# EasyEDA Pro project 工程技术综合实践课程设计.eprj, board 拓展板PCB
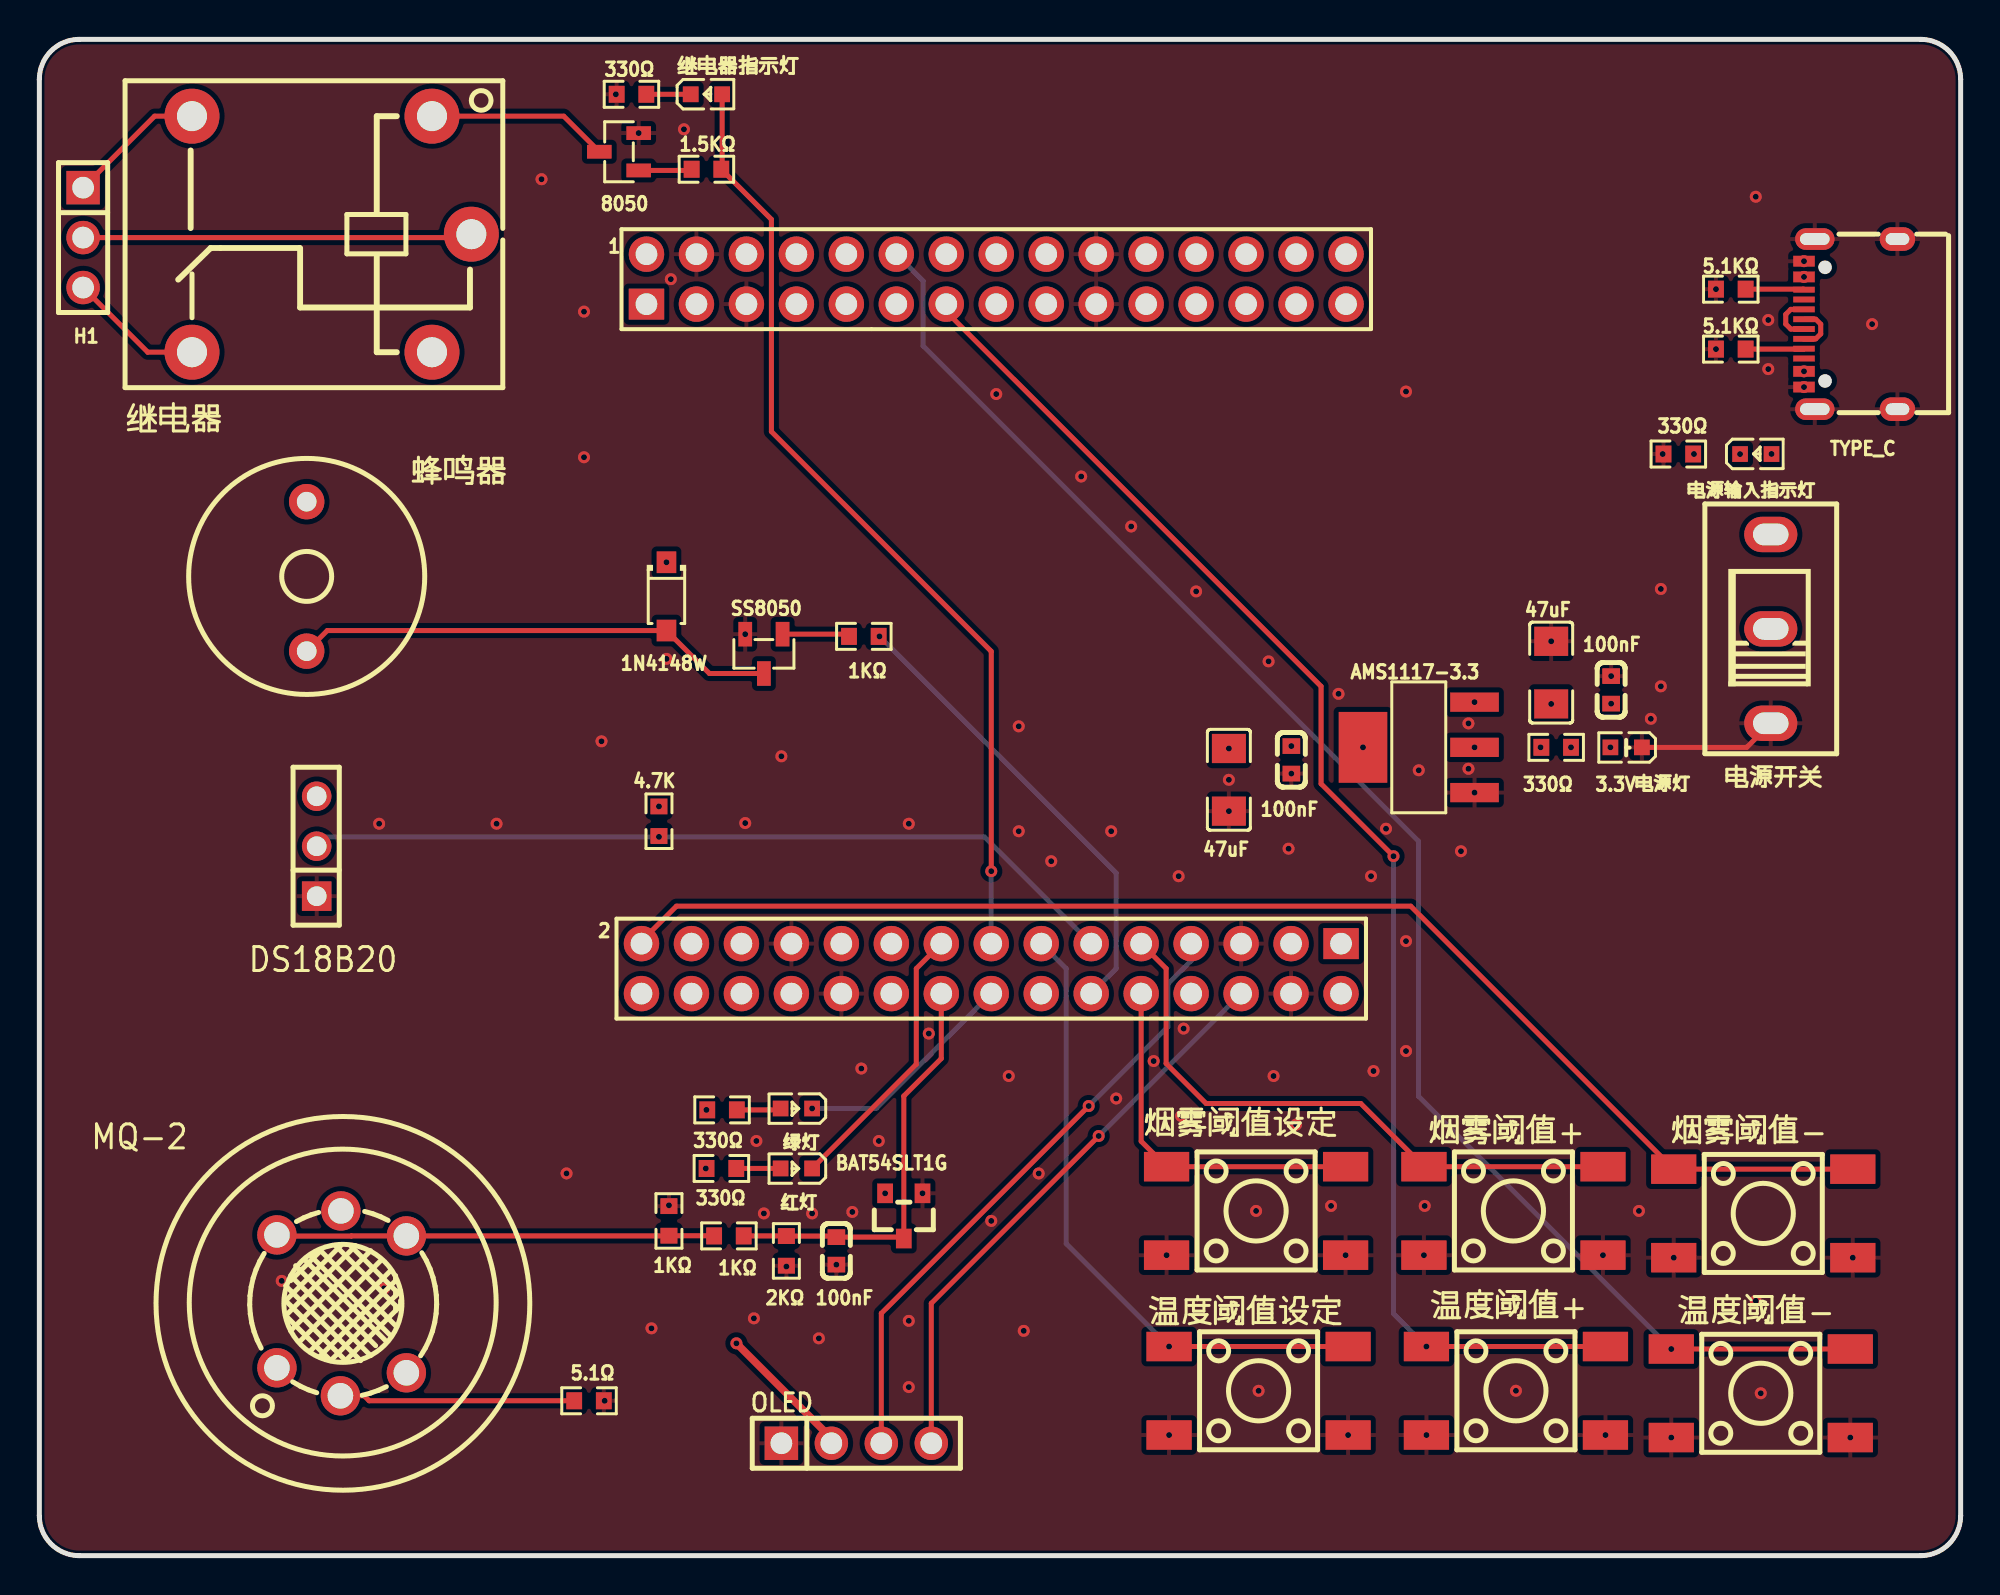
[diagram p2: board, top side]
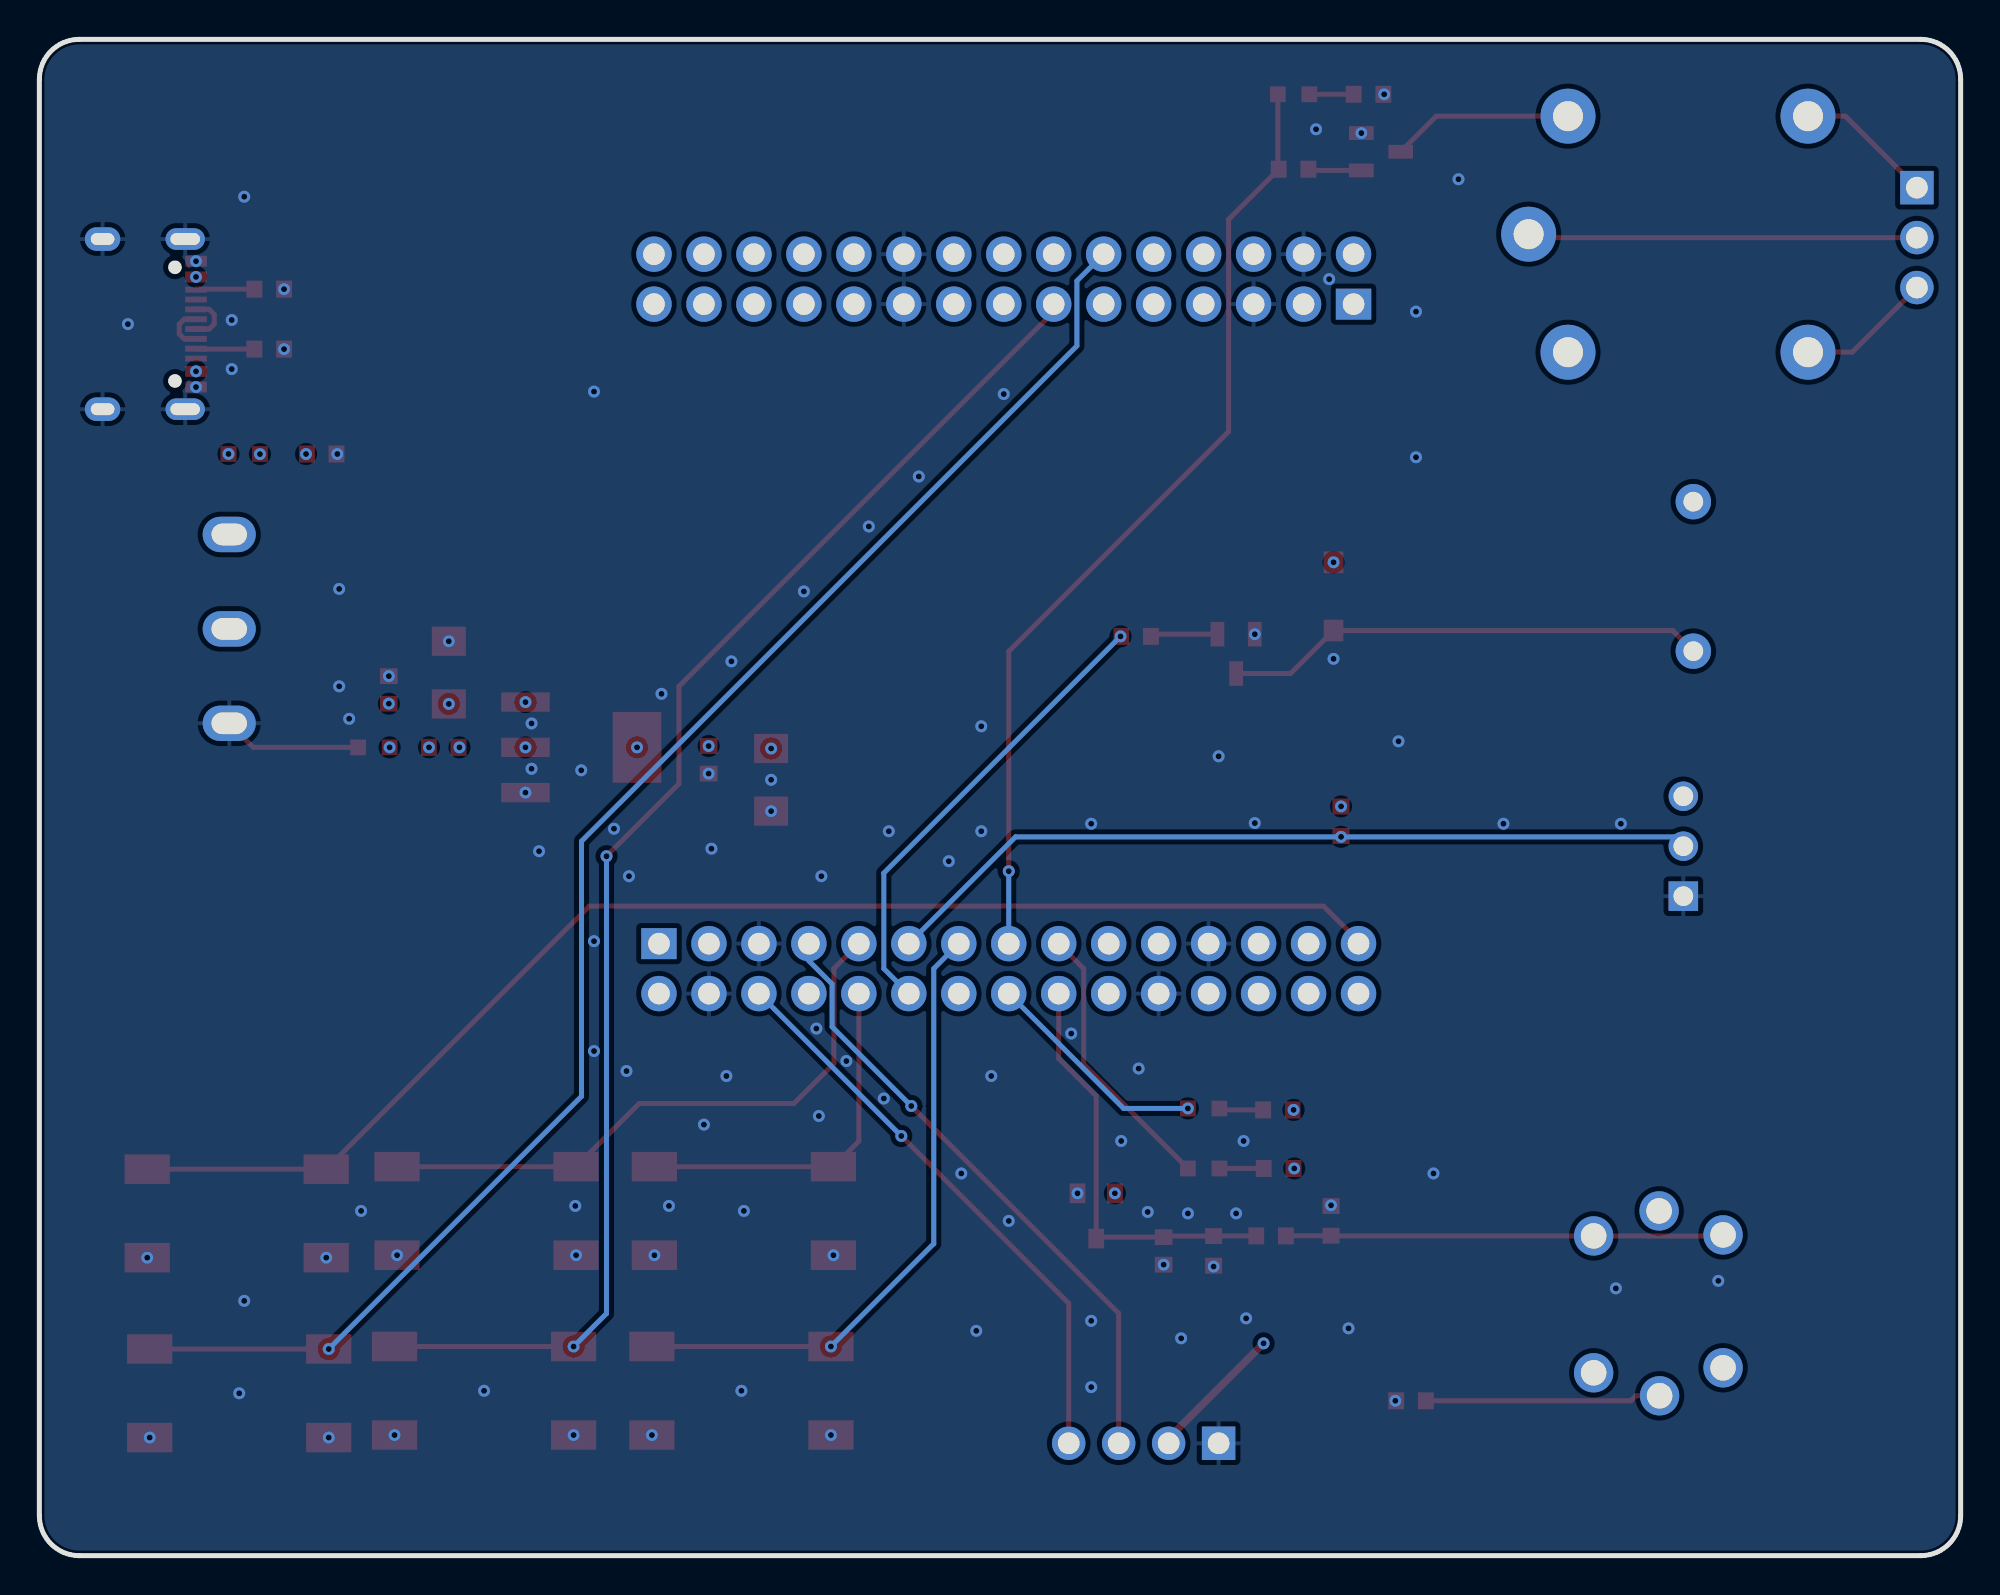
[diagram p3: board, bottom side, seen from below]

Outline 97.66 x 77.09 mm; copper layers: Top Layer, 电源层, GND, Bottom Layer. Coordinates in mm from the lower left corner of the outline.
Outline path: 0,75.06 0,2.03 arc(0.6,0.6) 2.03,0 95.63,0 arc(97.07,0.6) 97.66,2.03 97.66,75.06 arc(97.07,76.49) 95.63,77.09 2.03,77.09 arc(0.6,76.49) 0,75.06
Stack: Top Layer 0.035mm 外层铜厚1oz / Dielectric1 0.2104mm 7628 RC49% 8.6mil / 电源层 0.0152mm 内层铜厚 / Dielectric2 1.065mm 1.1mm H/HOZ Copper / GND 0.0152mm 内层铜厚 / Dielectric3 0.2104mm 7628 RC49% 8.6mil / Bottom Layer 0.035mm 外层铜厚1oz

## Design rules (mm)
template: JLCPCB Capability(Two Layers Board)
spacing copperThickness1oz (default): track to track 0.102, other pairs 0.152 to 0.3
spacing copperThickness2oz: track to track 0.203, other pairs 0.152 to 0.3
track width copperThickness1oz (default): min 0.127, default 0.254, max 2.54
track width copperThickness2oz: min 0.203, default 0.254, max 2.54
differential pair differentialPair (default): width min 0.127, default 0.254, max 2.54; gap min 0.152, default 0.152
via viaSize (default): diameter min 0.5, default 0.61, max 10; hole min 0.3, default 0.305, max 6.3

## Placement (name value [footprint] x y rotation side)
1  COM2X15_2.54_DIP  [HDR-TH_30P-P2.54-V-M-R2-C15-S2.54]  48.64 64.9 0 top
1.5KΩ  1.5kΩ  [R0603]  33.91 70.48 0 top
1KΩ  -  [R0603]  35.05 16.26 180 top
1KΩ#2  -  [R0603]  32 17.02 90 top
1KΩ#3  -  [R0603]  41.91 46.74 180 top
1N4148W  1N4148W  [SOD-123F_L2.7-W1.6-LS3.8-RD]  31.88 48.77 270 top
2  COM2X15_2.54_DIP  [HDR-TH_30P-P2.54-V-M-R2-C15-S2.54]  48.39 29.84 180 top
2KΩ  2kΩ  [R0603]  37.97 15.49 90 top
3.3V电源灯  KT-0603W  [LED0603-R-RD_WHITE]  80.66 41.09 180 top
4.7K  4.7kΩ  [R0603]  31.5 37.34 90 top
5.1KΩ  -  [R0603]  85.98 64.39 180 top
5.1KΩ#2  -  [R0603]  85.98 61.34 180 top
5.1Ω  5.1Ω  [R0603]  27.94 7.87 180 top
47uF  -  [C1206]  76.85 44.89 270 top
47uF#2  -  [C1206]  60.47 39.44 90 top
100nF  -  [C0603]  40.51 15.49 90 top
100nF#2  -  [C0603]  79.9 44.02 270 top
100nF#3  -  [C0603]  63.64 40.46 90 top
330Ω  -  [R0603]  30.1 74.3 0 top
330Ω#2  -  [R0603]  83.31 56.01 0 top
330Ω#3  -  [R0603]  77.1 41.09 0 top
330Ω#4  -  [R0603]  34.67 19.69 0 top
330Ω#5  -  [R0603]  34.7 22.66 0 top
8050  SS8050(RANGE:200-350)  [SOT-23-3_L2.9-W1.3-P1.90-LS2.4-BR]  29.46 71.37 0 top
AMS1117-3.3  AMS1117-3.3  [SOT-223-4_L6.5-W3.5-P2.30-LS7.0-BR]  70.12 41.09 0 top
BAT54SLT1G  BAT54SLT1G  [SOT-23_L2.9-W1.3-P1.90-LS2.4-BR]  43.94 17.27 90 top
DS18B20  排母2.54mm 1X3pin  [HDR-TH_3P-P2.54_CS-1165SDIG]  14.1 36.07 90 top
H1  PZ254V-11-03P  [HDR-TH_3P-P2.54-V-M]  2.22 67.01 270 top
MQ-2  MQ-2  [SENSOR-TH_MQ-2]  15.37 12.83 90 top
OLED  PM2.54-1*4  [HDR-TH_4P-P2.54-V-F]  41.53 5.72 0 top
SS8050  SS8050(RANGE:200-350)  [SOT-23-3_L2.9-W1.3-P1.90-LS2.4-BR]  36.83 45.85 90 top
TYPE_C  TYPE-C 16PIN 2MD(073)  [USB-C-SMD_TYPE-C-6PIN-2MD-073]  92.08 62.61 90 top
温度阈值+  KH-6X6X5H-STM  [SW-SMD_4P-L6.0-W6.0-P4.50-LS9.0_H5.0]  75.06 8.38 0 top
温度阈值-  KH-6X6X5H-STM  [SW-SMD_4P-L6.0-W6.0-P4.50-LS9.0_H5.0]  87.5 8.25 0 top
温度阈值设定  KH-6X6X5H-STM  [SW-SMD_4P-L6.0-W6.0-P4.50-LS9.0_H5.0]  61.98 8.38 0 top
烟雾阈值+  KH-6X6X5H-STM  [SW-SMD_4P-L6.0-W6.0-P4.50-LS9.0_H5.0]  74.93 17.53 0 top
烟雾阈值-  KH-6X6X5H-STM  [SW-SMD_4P-L6.0-W6.0-P4.50-LS9.0_H5.0]  87.63 17.4 0 top
烟雾阈值设定  KH-6X6X5H-STM  [SW-SMD_4P-L6.0-W6.0-P4.50-LS9.0_H5.0]  61.85 17.53 0 top
电源开关  SS-12D10G6-G  [SW-TH_SS-12D10G4-G]  88.01 47.12 90 top
电源输入指示灯  NCD0603Y2  [LED0603-RD]  87.25 56.01 0 top
红灯  NCD0603Y2  [LED0603-RD]  38.48 19.69 180 top
继电器  SRD-12VDC-SL-C  [RELAY-TH_SRD-XXVDC-XL-C]  14.86 67.18 180 top
继电器指示灯  NCD0603Y2  [LED0603-RD]  33.91 74.3 0 top
绿灯  NCD0603Y2  [LED0603-RD]  38.48 22.73 180 top
蜂鸣器  2.4kHz  [BUZ-TH_BD12.0-P7.60-D0.6-FD]  13.59 49.78 270 top

## Footprints (pads in the part's own frame, mm; a bottom-side part is the same pattern mirrored in y, then rotated)
BUZ-TH_BD12.0-P7.60-D0.6-FD
  round 1.8 hole 1: 1(-3.8,0) 2(3.8,0)
C0603
  rect 0.8x0.9 smd: 1(-0.7,0) 2(0.7,0)
C1206
  rect 1.485x1.728 smd: 1(-1.593,0) 2(1.593,0)
HDR-TH_3P-P2.54-V-M
  rect 1.7x1.7 hole 1.1: 1(-2.54,0)
  round 1.7 hole 1.1: 2(0,0) 3(2.54,0)
HDR-TH_3P-P2.54_CS-1165SDIG
  rect 1.5x1.5 hole 1: 1(-2.54,0)
  round 1.5 hole 1: 2(0,0) 3(2.54,0)
HDR-TH_4P-P2.54-V-F
  rect 1.7x1.7 hole 1.1: 1(-3.81,0)
  round 1.7 hole 1.1: 2(-1.27,0) 3(1.27,0) 4(3.81,0)
HDR-TH_30P-P2.54-V-M-R2-C15-S2.54
  rect 1.8x1.575 hole 1.1: 1(-17.78,-1.27)
  round 1.8 hole 1.1: 2(-17.78,1.27) 3(-15.24,-1.27) 4(-15.24,1.27) 5(-12.7,-1.27) 6(-12.7,1.27) 7(-10.16,-1.27) 8(-10.16,1.27) 9(-7.62,-1.27) 10(-7.62,1.27) 11(-5.08,-1.27) 12(-5.08,1.27) 13(-2.54,-1.27) 14(-2.54,1.27) 15(0,-1.27) 16(0,1.27) 17(2.54,-1.27) 18(2.54,1.27) 19(5.08,-1.27) 20(5.08,1.27) 21(7.62,-1.27) 22(7.62,1.27) 23(10.16,-1.27) 24(10.16,1.27) 25(12.7,-1.27) 26(12.7,1.27) 27(15.24,-1.27) 28(15.24,1.27) 29(17.78,-1.27) 30(17.78,1.27)
LED0603-R-RD_WHITE
  rect 0.8x0.8 smd: 1(0.8,0) 2(-0.8,0)
LED0603-RD
  rect 0.8x0.8 smd: 1(-0.799,0) 2(0.799,0)
R0603
  rect 0.806x0.864 smd: 1(-0.753,0) 2(0.753,0)
RELAY-TH_SRD-XXVDC-XL-C
  round 2.794 hole 1.524: 1(-5.1,-6) 2(7.1,-6) 3(7.1,6) 4(-5.1,6) 5(-7.1,0)
SENSOR-TH_MQ-2
  round 2 hole 1.3: 1(-3.276,3.289) 2(-4.699,0.064) 3(-3.53,-3.289) 4(3.429,-3.289) 5(4.699,0.038) 6(3.48,3.289)
SOD-123F_L2.7-W1.6-LS3.8-RD
  rect 1.1x1 smd: 1(-1.735,0) 2(1.735,0)
SOT-23-3_L2.9-W1.3-P1.90-LS2.4-BR
  rect 1.25x0.7 smd: 1(1,-0.95) 2(1,0.95) 3(-1,0)
SOT-23_L2.9-W1.3-P1.90-LS2.4-BR
  rect 1x0.8 smd: 1(1.15,-0.95) 2(1.15,0.95) 3(-1.15,0)
SOT-223-4_L6.5-W3.5-P2.30-LS7.0-BR
  rect 2.47x0.98 smd: 1(2.835,-2.3) 2(2.835,0) 3(2.835,2.3)
  rect 2.47x3.6 smd: 4(-2.835,0)
SW-SMD_4P-L6.0-W6.0-P4.50-LS9.0_H5.0
  rect 2.3x1.5 smd: 1(-4.55,2.25) 2(4.55,2.25) 3(-4.55,-2.25) 4(4.55,-2.25)
SW-TH_SS-12D10G4-G
  oval 1.8x2.7 hole 1.1x1.8: 1(-4.8,0) 2(-0.001,0) 3(4.8,0)
USB-C-SMD_TYPE-C-6PIN-2MD-073
  rect 0.55x1.1 smd: 1(-3.2,2.375) 2(-2.4,2.375) 11(2.4,2.375) 12(3.2,2.375)
  rect 0.3x1.1 smd: 3(-1.75,2.375) 4(-1.25,2.375) 5(-0.75,2.375) 6(-0.25,2.375) 7(0.25,2.375) 8(0.75,2.375) 9(1.25,2.375) 10(1.75,2.375)
  oval 1.1x2 hole 0.6x1.5: 13(-4.325,1.825) 14(4.325,1.825)
  oval 1.2x1.8 hole 0.6x1.2: 13(-4.325,-2.375) 14(4.325,-2.375)

## Nets
5V: 1.3 1.18 1N4148W.1 2.3 2.21 47uF.2 100nF#2.2 AMS1117-3.3.3 MQ-2.1 MQ-2.3 MQ-2.5 电源开关.2 继电器.4 蜂鸣器.1
GND: 1.4 1.5 1.19 1.20 1KΩ#2.2 2.4 2.5 2.22 2.23 2KΩ.1 3.3V电源灯.2 5.1KΩ.2 5.1KΩ#2.2 5.1Ω.1 47uF.1 47uF#2.1 100nF.1 100nF#2.1 100nF#3.1 330Ω.1 330Ω#2.1 8050.2 AMS1117-3.3.1 BAT54SLT1G.1 DS18B20.1 OLED.1 SS8050.2 TYPE_C.1 TYPE_C.12 TYPE_C.13 TYPE_C.14 温度阈值+.3 温度阈值+.4 温度阈值-.3 温度阈值-.4 温度阈值设定.3 温度阈值设定.4 烟雾阈值+.3 烟雾阈值+.4 烟雾阈值-.3 烟雾阈值-.4 烟雾阈值设定.3 烟雾阈值设定.4 电源开关.1
VCC: 1.1 1.2 1.16 1.17 2.1 2.2 2.19 2.20 4.7K.2 47uF#2.2 100nF#3.2 330Ω#3.1 330Ω#4.1 330Ω#5.1 AMS1117-3.3.2 AMS1117-3.3.4 BAT54SLT1G.2 DS18B20.3 OLED.2
VIN: TYPE_C.2 TYPE_C.11 电源开关.3 电源输入指示灯.2
PA0: 1KΩ.1 2.18 2KΩ.2 100nF.2 BAT54SLT1G.3
PA1: 2.17 红灯.1
PA2: 2.16 绿灯.1
PA3: 1.5KΩ.2 2.15 继电器指示灯.2
PA4: 2.14
PA5: 2.13 温度阈值设定.1 温度阈值设定.2
PA6: 1KΩ#3.1 2.12
PA7: 2.11 4.7K.1 DS18B20.2
PA8: 1.26
PA9: 1.25
PA10: 1.24
PA15: 1.14
PB0: 2.10 烟雾阈值设定.1 烟雾阈值设定.2
PB1: 2.9 烟雾阈值+.1 烟雾阈值+.2
PB3: 1.13 温度阈值+.1 温度阈值+.2
PB4: 1.12 温度阈值-.1 温度阈值-.2
PB5: 1.11
PB8: 1.7
PB9: 1.6
PB10: 2.7 OLED.3
PB11: 2.6 OLED.4
PB12: 1.30
PB13: 1.29
PB14: 1.28
PB15: 1.27
PC13: 2.29 烟雾阈值-.1 烟雾阈值-.2
PC14: 2.28
PC15: 2.27
PD0: 2.26
PD1: 2.25
SWCLK: 1.15
SWDIO: 1.21
USB1D_M: 1.23
USB1D_P: 1.22
USB2D_M: 1.10
USB2D_P: 1.9
USB_D+: TYPE_C.6 TYPE_C.8
USB_D-: TYPE_C.5 TYPE_C.7
$1N2372: 1KΩ.2 1KΩ#2.1 MQ-2.4 MQ-2.6
$1N2803: 1KΩ#3.2 SS8050.1
$1N3400: 5.1Ω.2 MQ-2.2
$1N3711: 1N4148W.2 SS8050.3 蜂鸣器.2
$1N4660: 330Ω#2.2 电源输入指示灯.1
$1N4756: 330Ω#4.2 红灯.2
$1N4760: 330Ω#5.2 绿灯.2
$1N5679: 8050.3 继电器.1
$1N5767: 1.5KΩ.1 8050.1
$1N5923: 330Ω.2 继电器指示灯.1
$1N6045: H1.2 继电器.5
$1N6055: H1.3 继电器.3
$1N6065: H1.1 继电器.2
$1N8581: 5.1KΩ.1 TYPE_C.10
$1N8582: 5.1KΩ#2.1 TYPE_C.4
$1N8605: 3.3V电源灯.1 330Ω#3.2

Pads without a net: 1 8; 2 8 24 30; TYPE_C 3 9

## Via types
v1: diameter 0.61, hole 0.305, Top Layer to Bottom Layer, 136 vias

## Routing (per net, layer and track width the routed paths; a pad name or vN(x,y) marks a point on that pad's centre or on a via; arc(x,y) is an arc through that point)
5V: length 259.1
  电源层 w0.381: 66.17,26.67 60.71,26.67 43.33,9.3 MQ-2.3 18.66,9.47 15.33,12.8 ; 66.17,26.67 67.56,26.67 84.21,43.32 ; 66.17,26.67 64.88,27.96 64.88,29.86 63.63,31.12 ; 15.33,12.8 MQ-2.1 ; 15.33,12.8 MQ-2.5 29.36,31.56 29.36,31.63 30.09,32.36 30.16,32.36 30.44,32.64 39.5,32.64 40.77,31.37 2.21 ; 36.34,68.34 49.01,68.34 ; 36.34,68.34 27.12,68.34 继电器.4 13.59,54.81 蜂鸣器.1 ; 36.34,68.34 34.67,66.67 34.67,64.9 1.3 32,62.23 32,50.63 v1(31.88,50.5) ; 49.01,68.34 67.29,68.34 71.63,64.01 71.63,44.72 v1(72.95,43.39) 73.05,43.3 v1(76.85,43.3) 76.86,43.32 v1(79.9,43.32) 84.21,43.32 ; 49.01,68.34 1.18 ; 电源开关.2 84.21,43.32
GND: length 355.5
  Top Layer w0.254: 电源开关.1 86.79,41.09 3.3V电源灯.2
  GND w0.254: v1(76.85,46.49) 78.13,46.49 v1(79.9,44.72) 85.61,44.72 电源开关.1 ; v1(76.85,46.49) 82.52,52.16 v1(82.52,56.01) 82.52,58.63 v1(85.23,61.34) ; v1(76.85,46.49) 74.8,44.44 74.8,40.64 v1(72.95,38.79) 64.61,38.79 v1(63.64,39.76) 62.37,39.76 v1(60.47,37.85) 60.47,31.74 2.5 66.4,25.8 v1(66.4,15.28) ; v1(37.97,14.7) 37.97,5.97 OLED.1 ; v1(37.97,14.7) 35.12,14.7 v1(32,17.81) 16.29,33.53 DS18B20.1 ; v1(37.97,14.7) 40.42,14.7 v1(40.51,14.79) 41.26,14.79 v1(44.89,18.42) 44.89,24.45 2.22 2.23 35.88,33.46 v1(35.88,37.24) v1(35.88,46.85) 35.94,46.91 1.5 ; OLED.1 40.26,3.18 54.74,3.18 57.43,5.86 v1(57.43,6.13) v1(66.53,6.13) v1(70.51,6.13) v1(79.61,6.13) 79.73,6 v1(82.95,6) v1(92.05,6) 92.18,6.13 v1(92.18,15.15) v1(83.08,15.15) 82.95,15.28 v1(79.48,15.28) v1(70.38,15.28) v1(66.4,15.28) ; OLED.1 35.56,7.87 v1(28.73,7.87) ; v1(85.23,61.34) 87.16,59.41 v1(89.7,59.41) 90.25,58.86 TYPE_C.13 TYPE_C.13 ; v1(85.23,61.34) v1(85.23,64.39) 86.65,65.81 v1(89.7,65.81) 90.25,66.36 TYPE_C.14 TYPE_C.14 ; v1(66.4,15.28) v1(57.3,15.28) ; 1.5 38.35,61.21 51.31,61.21 1.19 1.20 ; 1.5 1.4 33.4,69.39 v1(30.46,72.32) 29.3,73.48 v1(29.3,74.3)
  vias: v1(12.32,13.97) v1(17.27,37.21) v1(17.53,13.59) v1(23.24,37.21) v1(25.53,69.98) v1(26.8,19.43) v1(27.69,63.25) v1(27.69,55.84) v1(28.58,41.4) v1(31.11,11.56) v1(31.88,45.59) v1(32.1,64.9) v1(32.77,72.52) v1(36.32,12.06) v1(36.45,21.08) v1(36.83,17.4) v1(37.72,40.64) v1(39.28,17.4) v1(39.62,11.05) v1(41.33,17.47) v1(41.78,24.77) v1(42.67,21.08) v1(44.2,37.21) v1(44.2,11.94) v1(44.2,8.57) v1(45.21,26.54) v1(48.39,17.02) v1(48.64,59.06) v1(49.28,24.38) v1(49.78,42.16) v1(49.78,36.83) v1(50.04,11.43) v1(50.8,19.43) v1(51.44,35.31) v1(52.96,54.86) v1(54.48,36.83) v1(54.74,23.24) v1(55.5,52.32) v1(56.64,25.15) v1(57.91,34.54) v1(58.04,22.35) v1(58.17,26.8) v1(58.8,49.02) v1(60.47,39.44) v1(61.85,17.53) v1(61.98,8.38) v1(62.48,45.47) v1(62.74,24.38) v1(63.5,35.94) v1(63.88,21.91) v1(65.66,17.78) v1(66.04,43.81) v1(67.69,34.54) v1(67.82,24.64) v1(68.45,36.96) v1(69.47,59.18) v1(69.47,31.24) v1(69.47,25.65) v1(70.12,39.93) v1(70.42,17.78) v1(72.26,35.81) v1(72.64,42.31) v1(72.64,40.01) v1(75.06,8.38) v1(81.31,17.53) v1(81.92,42.55) v1(82.42,49.15) v1(82.42,44.2) v1(87.25,69.09) v1(87.25,12.95) v1(87.5,8.25) v1(87.88,62.82) v1(87.88,60.33) v1(93.16,62.61)
VCC: length 197.5
  Top Layer w0.381: v1(35.43,10.8) 40.26,5.97 OLED.2
  电源层 w0.381: 2.2 2.1 66.17,39.98 v1(67.28,41.09) ; 1.2 1.1 30.86,43.36 36.13,38.09 ; 1.16 1.17 51.18,39.88 52.97,38.09 ; v1(33.88,19.69) 33.88,12.35 v1(35.43,10.8) ; v1(33.88,19.69) 33.91,19.72 v1(33.91,22.66) 35.5,24.26 38.99,24.26 2.20 2.19 43.56,31.12 45.85,33.4 52.83,33.4 57.47,38.04 ; v1(33.88,19.69) 35.14,18.42 v1(42.99,18.42) ; 36.13,38.09 v1(31.5,38.09) 14.61,38.09 DS18B20.3 ; 36.13,38.09 52.97,38.09 ; 52.97,38.09 57.42,38.09 57.47,38.04 ; v1(67.28,41.09) v1(72.95,41.09) v1(76.31,41.09) ; v1(67.28,41.09) 63.71,41.09 v1(63.64,41.16) 63.52,41.04 v1(60.47,41.04) 57.47,38.04
VIN: length 14.1
  电源层 w0.381: 电源开关.3 88.05,51.95 v1(88.05,56.01) 88.01,56.05 88.01,58.93 89.29,60.21 v1(89.7,60.21) v1(89.7,65.01)
PA0: length 21.4
  Top Layer w0.254: 45.85,28.58 45.85,25.27 43.94,23.37 BAT54SLT1G.3 43.87,16.19 100nF.2 40.46,16.25 2KΩ.2 37.96,16.26 1KΩ.1
PA1: length 14.1
  Top Layer w0.254: 红灯.1 44.58,24.98 44.58,29.84 45.85,31.12
PA2: length 11.5
  Bottom Layer w0.254: 2.16 42.55,22.74 v1(39.28,22.74)
PA3: length 48.9
  Top Layer w0.254: v1(48.39,34.8) 48.39,45.97 37.21,57.15 37.21,67.94 1.5KΩ.2 34.71,70.53 继电器指示灯.2
  Bottom Layer w0.254: v1(48.39,34.8) 2.15
PA5: length 32.3
  Top Layer w0.254: v1(57.43,10.63) 温度阈值设定.2
  Bottom Layer w0.254: 2.13 52.2,29.84 52.2,15.86 v1(57.43,10.63)
PA6: length 23.7
  Bottom Layer w0.254: v1(42.7,46.74) 54.74,34.7 54.74,29.84 53.47,28.58
PA7: length 41.8
  Bottom Layer w0.254: 53.47,31.12 48.04,36.54 v1(31.5,36.54) 14.57,36.54 DS18B20.2
PB0: length 18.4
  Top Layer w0.254: 烟雾阈值设定.2 烟雾阈值设定.1 56.01,21.07 56.01,28.58
PB1: length 31
  Top Layer w0.254: 56.01,31.12 57.28,29.84 57.28,25.02 59.31,22.99 67.17,22.99 烟雾阈值+.1 烟雾阈值+.2
PB3: length 72.2
  Top Layer w0.254: v1(70.51,10.63) 温度阈值+.2 ; v1(68.83,35.56) 65.15,39.24 65.15,44.2 46.1,63.25 1.13
  Bottom Layer w0.254: v1(68.83,35.56) 68.83,12.31 v1(70.51,10.63)
PB4: length 81.1
  Top Layer w0.254: v1(82.95,10.5) 92.05,10.5
  Bottom Layer w0.254: v1(82.95,10.5) 70.1,23.35 70.1,36.32 44.92,61.5 44.92,64.81 1.12
PB10: length 31.9
  Top Layer w0.254: 42.8,5.72 42.8,12.32 v1(53.34,22.86)
  Bottom Layer w0.254: 2.7 58.55,30.24 57.37,29.06 57.37,26.89 v1(53.34,22.86)
PB11: length 29.4
  Top Layer w0.254: OLED.4 45.34,12.83 v1(53.85,21.34)
  Bottom Layer w0.254: 2.6 v1(53.85,21.34)
PC13: length 68
  Top Layer w0.254: 烟雾阈值-.2 烟雾阈值-.1 69.71,33.02 32.39,33.02 30.61,31.24 2.29
USB_D+: length 2.6
  Top Layer w0.254: TYPE_C.8 89.03,63.36 88.77,63.11 88.77,62.62 89.03,62.36 TYPE_C.6
USB_D-: length 2.4
  Top Layer w0.254: TYPE_C.7 90.3,62.86 90.55,62.61 90.55,62.12 90.3,61.86 TYPE_C.5
$1N2372: length 22.3
  Top Layer w0.254: 12.08,16.31 12.14,16.25 15.86,16.25 15.87,16.26 MQ-2.4 32,16.26 1KΩ#2.1 34.29,16.26 1KΩ.2
$1N2803: length 3.4
  Top Layer w0.254: 1KΩ#3.2 41.05,46.85 SS8050.1
$1N3400: length 12
  Top Layer w0.254: 5.1Ω.2 16.76,7.87 16.51,8.13 MQ-2.2
$1N3711: length 24.6
  Top Layer w0.254: 蜂鸣器.2 14.64,47.03 1N4148W.2 34.06,44.85 SS8050.3
$1N4660: length 2.3
  电源层 w0.381: v1(86.45,56) 84.11,56 v1(84.11,56.01)
$1N4756: length 2.3
  Top Layer w0.254: 330Ω#4.2 红灯.2
$1N4760: length 2.3
  Top Layer w0.254: 330Ω#5.2 37.61,22.66 绿灯.2
$1N5679: length 9.3
  Top Layer w0.254: 8050.3 26.66,73.18 继电器.1
$1N5767: length 2.7
  Top Layer w0.254: 8050.1 33.09,70.42 1.5KΩ.1
$1N5923: length 2.3
  Top Layer w0.254: 330Ω.2 继电器指示灯.1
$1N6045: length 19.8
  Top Layer w0.254: H1.2 21.79,67.01 继电器.5
$1N6055: length 6.9
  Top Layer w0.254: H1.3 5.51,61.18 7.76,61.18
$1N6065: length 7
  Top Layer w0.254: 7.76,73.18 5.86,73.18 H1.1
$1N8581: length 3
  Top Layer w0.254: 5.1KΩ.1 89.67,64.39 TYPE_C.10
$1N8582: length 3
  Top Layer w0.254: 5.1KΩ#2.1 89.68,61.34 TYPE_C.4
$1N8605: length 2
  电源层 w0.381: v1(77.86,41.09) v1(79.86,41.09)

## Copper pours and planes (outline as drawn; the poured copper is in the pictures)
GND on Top Layer: -0.13,75.18 -0.12,75.36 -0.07,75.64 0.01,75.91 0.13,76.17 0.28,76.41 0.47,76.62 0.68,76.81 0.92,76.96 1.18,77.08 1.45,77.16 1.73,77.21 1.91,77.22 95.76,77.22 95.94,77.21 96.22,77.16 96.49,77.08 96.74,76.96 96.98,76.81 97.19,76.62 97.38,76.41 97.54,76.17 97.66,75.91 97.74,75.64 97.78,75.36 97.79,75.18 97.79,1.91 97.78,1.73 97.74,1.45 97.66,1.18 97.54,0.92 97.38,0.68 97.19,0.47 96.98,0.28 96.74,0.13 96.49,0.01 96.22,-0.07 95.94,-0.12 95.76,-0.13 1.91,-0.13 1.73,-0.12 1.45,-0.07 1.18,0.01 0.92,0.13 0.68,0.28 0.47,0.47 0.28,0.68 0.13,0.92 0.01,1.18 -0.07,1.45 -0.12,1.73 -0.13,1.91
GND on Bottom Layer: -0.13,75.18 -0.12,75.36 -0.07,75.64 0.01,75.91 0.13,76.17 0.28,76.41 0.47,76.62 0.68,76.81 0.92,76.96 1.18,77.08 1.45,77.16 1.73,77.21 1.91,77.22 95.76,77.22 95.94,77.21 96.22,77.16 96.49,77.08 96.74,76.96 96.98,76.81 97.19,76.62 97.38,76.41 97.54,76.17 97.66,75.91 97.74,75.64 97.78,75.36 97.79,75.18 97.79,1.91 97.78,1.73 97.74,1.45 97.66,1.18 97.54,0.92 97.38,0.68 97.19,0.47 96.98,0.28 96.74,0.13 96.49,0.01 96.22,-0.07 95.94,-0.12 95.76,-0.13 1.91,-0.13 1.73,-0.12 1.45,-0.07 1.18,0.01 0.92,0.13 0.68,0.28 0.47,0.47 0.28,0.68 0.13,0.92 0.01,1.18 -0.07,1.45 -0.12,1.73 -0.13,1.91
GND on 电源层: -0.13,75.18 -0.12,75.36 -0.07,75.64 0.01,75.91 0.13,76.17 0.28,76.41 0.47,76.62 0.68,76.81 0.92,76.96 1.18,77.08 1.45,77.16 1.73,77.21 1.91,77.22 95.76,77.22 95.94,77.21 96.22,77.16 96.49,77.08 96.74,76.96 96.98,76.81 97.19,76.62 97.38,76.41 97.54,76.17 97.66,75.91 97.74,75.64 97.78,75.36 97.79,75.18 97.79,1.91 97.78,1.73 97.74,1.45 97.66,1.18 97.54,0.92 97.38,0.68 97.19,0.47 96.98,0.28 96.74,0.13 96.49,0.01 96.22,-0.07 95.94,-0.12 95.76,-0.13 1.91,-0.13 1.73,-0.12 1.45,-0.07 1.18,0.01 0.92,0.13 0.68,0.28 0.47,0.47 0.28,0.68 0.13,0.92 0.01,1.18 -0.07,1.45 -0.12,1.73 -0.13,1.91
GND on GND: -0.13,75.18 -0.12,75.36 -0.07,75.64 0.01,75.91 0.13,76.17 0.28,76.41 0.47,76.62 0.68,76.81 0.92,76.96 1.18,77.08 1.45,77.16 1.73,77.21 1.91,77.22 95.76,77.22 95.94,77.21 96.22,77.16 96.49,77.08 96.74,76.96 96.98,76.81 97.19,76.62 97.38,76.41 97.54,76.17 97.66,75.91 97.74,75.64 97.78,75.36 97.79,75.18 97.79,1.91 97.78,1.73 97.74,1.45 97.66,1.18 97.54,0.92 97.38,0.68 97.19,0.47 96.98,0.28 96.74,0.13 96.49,0.01 96.22,-0.07 95.94,-0.12 95.76,-0.13 1.91,-0.13 1.73,-0.12 1.45,-0.07 1.18,0.01 0.92,0.13 0.68,0.28 0.47,0.47 0.28,0.68 0.13,0.92 0.01,1.18 -0.07,1.45 -0.12,1.73 -0.13,1.91
